# EAGLE design BTDataLogger_Schematic (EAGLE 9.2.0)
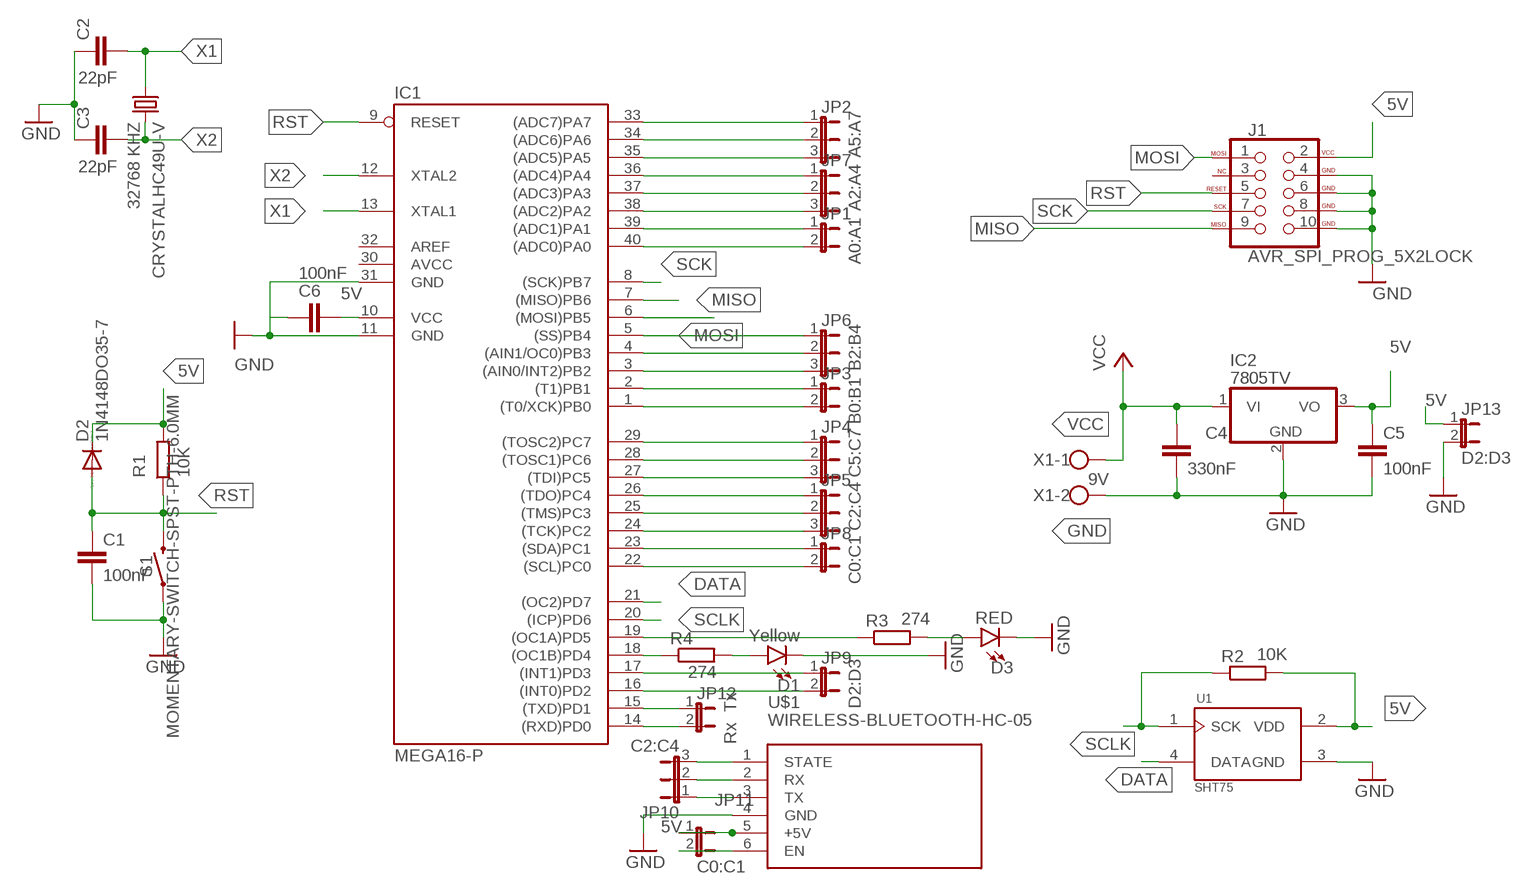
[diagram p0: schematic, sheet 1]

## Parts
C1  100nF  C-EU025-024X044  [C025-024X044]
C2  22pF  C-EU025-024X044  [C025-024X044]
C3  22pF  C-EU025-024X044  [C025-024X044]
C4  330nF  C5/3  [C5B3]
C5  100nF  C-EU025-024X044  [C025-024X044]
C6  100nF  C-EU025-024X044  [C025-024X044]
CRYSTALHC49U-V  32768 KHZ  CRYSTALHC49U-V  [HC49U-V]
D1  Yellow  LED-YELLOW0603  [LED-0603]
D2  1N4148DO35-7  [DO35-7]
D3  RED  LED-RED0603  [LED-0603]
IC1  MEGA16-P  [DIL40]
IC2  7805TV  [TO220V]
J1  AVR_SPI_PROG_5X2LOCK  [2X5-SHROUDED_LOCK]
JP1  A0:A1  JP1E  [JP1]
JP2  A5:A7  JP2E  [JP2]
JP3  B0:B1  JP1E  [JP1]
JP4  C5:C7  JP2E  [JP2]
JP5  C2:C4  JP2E  [JP2]
JP6  B2:B4  JP2E  [JP2]
JP7  A2:A4  JP2E  [JP2]
JP8  C0:C1  JP1E  [JP1]
JP9  D2:D3  JP1E  [JP1]
JP10  C2:C4  JP2E  [JP2]
JP11  C0:C1  JP1E  [JP1]
JP12  Rx Tx  JP1E  [JP1]
JP13  D2:D3  JP1E  [JP1]
R1  10K  R  (no package)
R2  10K  R-EU_0207/10  [0207/10]
R3  274  R-EU_0207/10  [0207/10]
R4  274  R-EU_0207/10  [0207/10]
S1  MOMENTARY-SWITCH-SPST-PTH-6.0MM  [TACTILE_SWITCH_PTH_6.0MM]
U1  SHT75  [SIP310W46P127L508H1350Q4P]
U$1  WIRELESS-BLUETOOTH-HC-05  [WIRELESS-BLUETOOTH-HC-05]
X1  9V  W237-102  [W237-102]

## Nets
5V: C5.1 C6.1 D2.C IC1.10(VCC) IC2.3(VO) J1.2(VCC) JP11.1 JP13.1 R1.2 R2.2 U1.2(VDD) U$1.5(+5V)
DATA: IC1.21((OC2)PD7) U1.4(DATA)
GND: C1.2 C2.1 C3.1 C4.2 C5.2 C6.2 D1.C D3.C IC1.11(GND) IC1.31(GND) IC2.2(GND) J1.4(GND) J1.6(GND) J1.8(GND) J1.10(GND) JP13.2 S1.1 U1.3(GND) U$1.4(GND) X1.2
MISO: IC1.7((MISO)PB6) J1.9(MISO)
MOSI: IC1.6((MOSI)PB5) J1.1(MOSI)
N$1: JP10.3 U$1.1(STATE)
N$2: JP10.2 U$1.2(RX)
N$3: IC1.18((OC1B)PD4) R4.1
N$4: D1.A R4.2
N$5: D3.A R3.2
N$6: IC1.19((OC1A)PD5) R3.1
N$7: IC1.33((ADC7)PA7) JP2.1
N$8: IC1.34((ADC6)PA6) JP2.2
N$9: IC1.35((ADC5)PA5) JP2.3
N$10: IC1.36((ADC4)PA4) JP7.1
N$11: IC1.37((ADC3)PA3) JP7.2
N$12: IC1.38((ADC2)PA2) JP7.3
N$13: IC1.5((SS)PB4) JP6.1
N$14: IC1.4((AIN1/OC0)PB3) JP6.2
N$15: IC1.3((AIN0/INT2)PB2) JP6.3
N$16: IC1.29((TOSC2)PC7) JP4.1
N$17: IC1.28((TOSC1)PC6) JP4.2
N$18: IC1.27((TDI)PC5) JP4.3
N$19: IC1.26((TDO)PC4) JP5.1
N$20: IC1.25((TMS)PC3) JP5.2
N$21: IC1.24((TCK)PC2) JP5.3
N$22: IC1.39((ADC1)PA1) JP1.1
N$23: IC1.40((ADC0)PA0) JP1.2
N$24: IC1.2((T1)PB1) JP3.1
N$25: IC1.1((T0/XCK)PB0) JP3.2
N$26: IC1.23((SDA)PC1) JP8.1
N$27: IC1.22((SCL)PC0) JP8.2
N$28: IC1.17((INT1)PD3) JP9.1
N$29: IC1.16((INT0)PD2) JP9.2
N$30: JP10.1 U$1.3(TX)
N$31: JP11.2 U$1.6(EN)
N$32: IC1.15((TXD)PD1) JP12.1
N$33: IC1.14((RXD)PD0) JP12.2
RST: C1.1 D2.A IC1.9(RESET) J1.5(RESET) R1.1 S1.3
SCK: IC1.8((SCK)PB7) J1.7(SCK)
SCLK: IC1.20((ICP)PD6) R2.1 U1.1(SCK)
VCC: C4.1 IC2.1(VI) X1.1
X1: C2.2 CRYSTALHC49U-V.1 IC1.13(XTAL1)
X2: C3.2 CRYSTALHC49U-V.2 IC1.12(XTAL2)
Unconnected: IC1.32(AREF) J1.3(NC)

## Power pins joined to a net without a drawn wire
AVCC: IC1.30(AVCC)

## Library data of the parts
C1-C3 C5 C6 = rcl:C-EU: CAPACITOR, European symbol; SPICEPREFIX: C
C4 = capacitor-wima:C: CAPACITOR naming: grid - package width
CRYSTALHC49U-V = crystal:CRYSTAL: CRYSTAL; OC_FARNELL: 1666969; OC_NEWARK: unknown
D1 = SparkFun-LED:LED-YELLOW: Yellow SMD LED Used in manufacturing several products at SparkFun. Packages: 0603 - SMD 0603 package[Product Link] <http://www.kingbrightusa.com/product.asp?catalog_name=LED&product_id=APT1608SYCK> 0603 -SMART - SMART SMD 0603 package (more efficient/more expensive) [Product Link] <http://www.osram-os.com/osram_os/en/products/product-catalog/led-light-emitting-diodes/smartled-0603/ly-l29k/index.jsp> LilyPad - SMD1206 package[Product Datasheet] <https://www.sparkfun.com/datasheets/DevTools/LilyPad/Q150YUS4.pdf> SparkFun Products: Blynk Board <https://www.sparkfun.com/products/13794> IOIO-OTG <https://www.sparkfun.com/products/13613> XBee Explorer Serial <https://www.sparkfun.com/products/13225>; PROD_ID: DIO-09003
D2 = diode:1N4148: DIODE high speed (Philips)
D3 = SparkFun-LED:LED-RED: Red SMD LED Used in manufacturing of most products at SparkFun Packages: 0603 - SMD 0603 package [Product Link] <http://docs.avagotech.com/docs/AV02-0551EN> 0603 SMART - SMD 0603 SMART package ( more efficient and expensive)[Product Link] <http://www.osram-os.com/Graphics/XPic2/00077099_0.pdf> 1206 - SMD1206 package [Product Link] <https://www.sparkfun.com/datasheets/DevTools/LilyPad/Q150OVS4.pdff> SparkFun Products: Pro Mini 328 -5V <https://www.sparkfun.com/products/821> RedBoard <https://www.sparkfun.com/products/12757> IOIO-OTG <https://www.sparkfun.com/products/13613>; PROD_ID: DIO-00819
IC1 = atmel:MEGA16-P: MICROCONTROLLER 16 Kbytes FLASH 1 kbytes SRAM 512 bytes EEPROM USART 8-channel 10 bit ADC Source: avr.lbr; MPN: ATMEGA16-16PU; OC_FARNELL: 9171142; OC_NEWARK: 01M6885
IC2 = linear:78*: Positive VOLTAGE REGULATOR Source: http://cache.national.com/ds/LM/LM78L05.pdf http://www.fairchildsemi.com/ds/LM/LM7805.pdf
J1 = SparkFun-Connectors:AVR_SPI_PROG_5X2: AVR 10-pin ICSP Header This is the standard AVR In Circuit Serial Programming header. Minimal, but includes pin one indicator. Works with standard Olimex programmers. SparkFun Products: 2x5 AVR ICSP Male Header <https://www.sparkfun.com/products/778> - PTH 2x5 Pin Shrouded Header <https://www.sparkfun.com/products/8506> - PTH2; PROD_ID: CONN-08671; SF_ID: PRT-08506
JP1 JP3 JP8 JP9 JP11-JP13 = jumper:JP1E: JUMPER
JP2 JP4-JP7 JP10 = jumper:JP2E: JUMPER
R1 = ngspice-simulation:R: RESISTOR
R2-R4 = rcl:R-EU_: RESISTOR, European symbol; SPICEPREFIX: R
S1 = SparkFun-Switches:MOMENTARY-SWITCH-SPST: Momentary Switch (Pushbutton) - SPST Normally-open (NO) SPST momentary switches (buttons, pushbuttons). Variants PTH-12MM - 12mm square, through-hole Momentary Pushbutton Switch - 12mm Square <https://www.sparkfun.com/products/9190> (COM-09190) PTH-6.0MM, PTH-6.0MM-KIT - 6.0mm square, through-hole Mini Pushbutton Switch <https://www.sparkfun.com/products/97> (COM-00097) KIT package intended for soldering kit's - only one side of pads' copper is exposed. PTH-RIGHT-ANGLE-KIT - Right-angle, through-hole Right Angle Tactile Button <https://www.sparkfun.com/products/10791> - Used on SparkFun BigTime Watch Kit <https://www.sparkfun.com/products/11734> SMD-12MM - 12mm square, surface-mount Tactile Button - SMD (12mm) <https://www.sparkfun.com/products/12993> (COM-12993) Used on SparkFun PicoBoard <https://www.sparkfun.com/products/11888> SMD-4.5MM - 4.5mm Square Trackball Switch Used on SparkFun Blackberry Trackballer Breakout <https://www.sparkfun.com/products/13169> SMD-4.6MMX2.8MM - 4.60mm x 2.80mm, surface mount Used on SparkFun SAMD21 Mini Breakout <https://www.sparkfun.com/products/13664> SMD-5.2MM, SMD-5.2-REDUNDANT - 5.2mm square, surface-mount Mini Pushbutton Switch - SMD <https://www.sparkfun.com/products/8720> (COM-08720) Used on Arduino Pro Mini <https://www.sparkfun.com/products/11114> REDUNDANT package connects both switch circuits together SMD-6.0X3.5MM - 6.0 x 3.5mm, surface mount Momentary Reset Switch SMD <https://www.sparkfun.com/products/8229> (COM-08229) SMD-6.2MM-TALL - 6.2mm square, surface mount Tactile Button - SMD (6mm) <https://www.sparkfun.com/products/12992> Used on SparkFun Digital Sandbox <https://www.sparkfun.com/products/12651> SMD-RIGHT-ANGLE - Right-angle, surface mount Used on SparkFun Block for Intel® Edison - Arduino <https://www.sparkfun.com/products/13036>; PROD_ID: SWCH-08441; SF_SKU: COM-00097
U1 = SHT75:SHT75: SHT7X Series 5.5 V -40 to +125°C Digital Humidity & Temperature Sensor; AVAILABILITY: Unavailable; DESCRIPTION: SHT7X Series 5.5 V -40 to +125°C Digital Humidity & Temperature Sensor; MF: Sensirion AG; MP: SHT75; PACKAGE: SIP-4 Sensirion; PRICE: None
U$1 = diy-modules:WIRELESS-BLUETOOTH-HC-05: Bluetooth Transceiver Module based on HC-05 board Tutorial is available here: https://arduino-info.wikispaces.com/BlueTooth-HC05-HC06-Modules-How-To Click here to find device on ebay.com <http://www.ebay.com/sch/hc-05+module+rs232>
X1 = con-wago-500:W237-102: WAGO SCREW CLAMP; MPN: 237-102; OC_FARNELL: unknown; OC_NEWARK: 70K9898

## Net classes
0 default: width 0.305 mm, drill 0.508 mm, clearance 0.127 mm

## Board
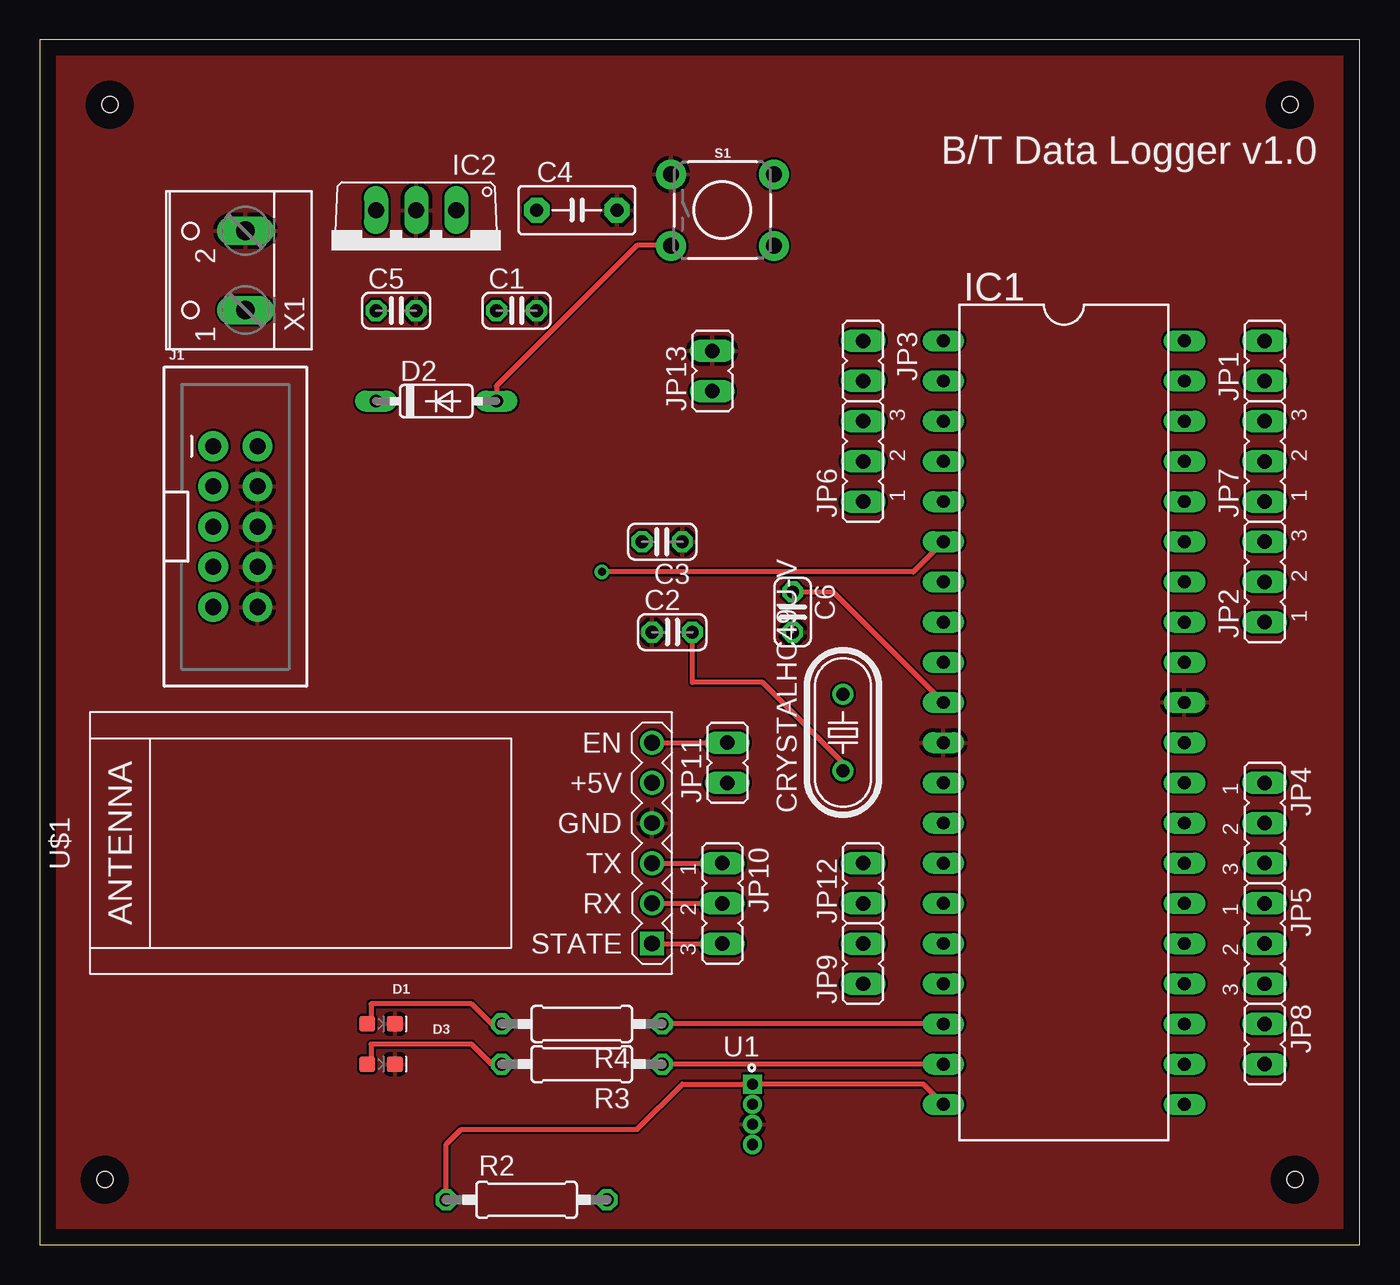
[diagram p1: board, top side]
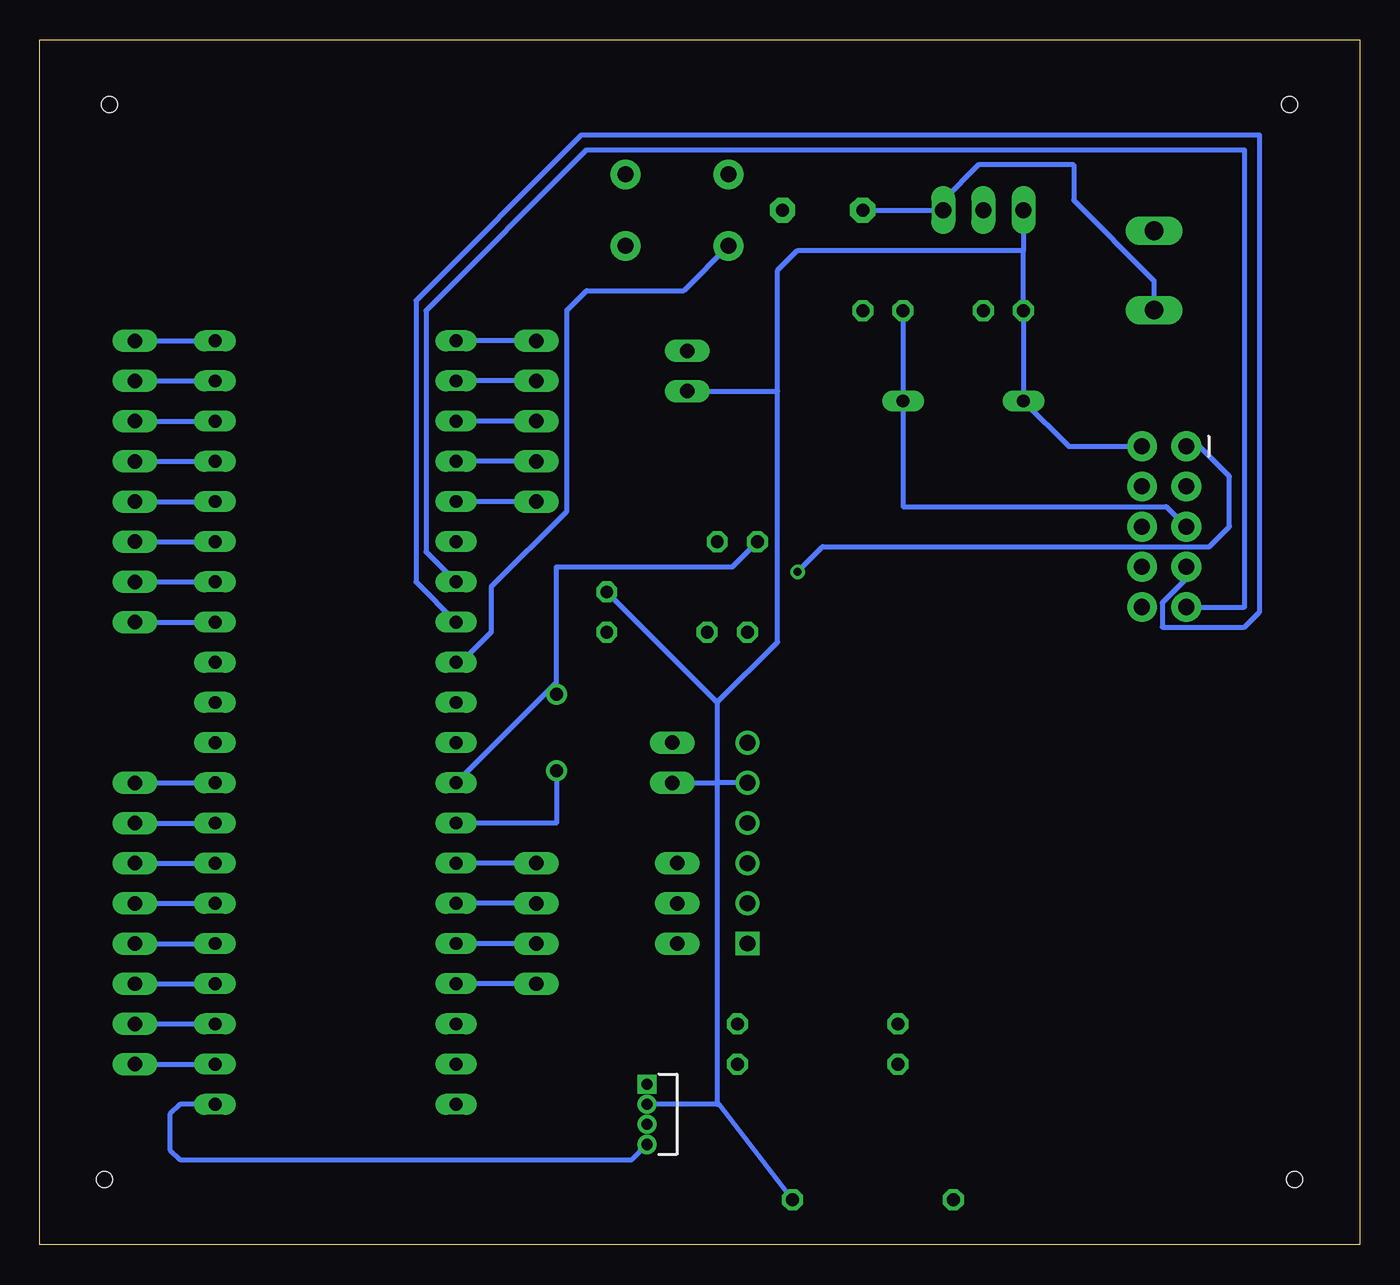
[diagram p2: board, bottom side, seen from below]

Size 83.49 x 76.19 mm. Coordinates in mm from the lower left corner, seen from the top.
Outline: 0,0 83.49,0 83.49,76.19 0,76.19 0,0
Copper layers (1*16): Top 0.035mm / dielectric 1.5mm / Bottom 0.035mm
Design rules "default": minimum track width 6mil, minimum drill 0.35mm, track to track 6mil, track to pad 6mil, pad to pad 6mil, via to via 6mil, smd to smd 6mil, copper to edge 40mil, drill to drill 6mil, minimum pad ring 10mil, minimum via ring 8mil, stop-mask expansion 4mil, vias tented up to drill 0mil, thermal gap 10mil
Holes 1 mm at 4.45,72.07 79.06,72.07 79.38,4.13 4.13,4.13

### Footprints (pad centres in the part's own frame; a part is rotated, then mirrored left to right if it is on the bottom)
C025-024X044 = drill 0.813 octagon: 1 -1.27,0; 2 1.27,0
C5B3 = drill 0.813 pad 1.6 octagon: 1 -2.54,0; 2 2.54,0
HC49U-V = drill 0.813: 1 -2.413,0; 2 2.413,0
LED-0603 = smd 1 x 1: A -0.877,0; C 0.877,0
DO35-7 = drill 0.813 long: A 3.81,0; C -3.81,0
DIL40 = drill 0.813 long: 1 -24.13,-7.62; 2 -21.59,-7.62; 3 -19.05,-7.62; 4 -16.51,-7.62; 5 -13.97,-7.62; 6 -11.43,-7.62; 7 -8.89,-7.62; 8 -6.35,-7.62; 9 -3.81,-7.62; 10 -1.27,-7.62; 11 1.27,-7.62; 12 3.81,-7.62; 13 6.35,-7.62; 14 8.89,-7.62; 15 11.43,-7.62; 16 13.97,-7.62; 17 16.51,-7.62; 18 19.05,-7.62; 19 21.59,-7.62; 20 24.13,-7.62; 21 24.13,7.62; 22 21.59,7.62; 23 19.05,7.62; 24 16.51,7.62; 25 13.97,7.62; 26 11.43,7.62; 27 8.89,7.62; 28 6.35,7.62; 29 3.81,7.62; 30 1.27,7.62; 31 -1.27,7.62; 32 -3.81,7.62; 33 -6.35,7.62; 34 -8.89,7.62; 35 -11.43,7.62; 36 -13.97,7.62; 37 -16.51,7.62; 38 -19.05,7.62; 39 -21.59,7.62; 40 -24.13,7.62
TO220V = drill 1.016 long: 1 -2.54,-2.54; 2 0,-2.54; 3 2.54,-2.54
2X5-SHROUDED_LOCK = drill 1.016 pad 1.88: 1 -1.397,5.08; 2 1.397,5.08; 3 -1.397,2.54; 4 1.397,2.54; 5 -1.397,0; 6 1.397,0; 7 -1.397,-2.54; 8 1.397,-2.54; 9 -1.397,-5.08; 10 1.397,-5.08
JP1 = drill 0.914 long: 1 0,-1.27; 2 0,1.27
JP2 = drill 0.914 long: 1 -2.54,0; 2 0,0; 3 2.54,0
0207/10 = drill 0.813 octagon: 1 -5.08,0; 2 5.08,0
TACTILE_SWITCH_PTH_6.0MM = drill 1.016 pad 1.88: 1 -3.251,2.261; 2 3.251,2.261; 3 -3.251,-2.261; 4 3.251,-2.261
SIP310W46P127L508H1350Q4P = drill 0.7 pad 1.05 square: 1 0,1.905 | drill 0.7 pad 1.05: 2 0,0.635; 3 0,-0.635; 4 0,-1.905
WIRELESS-BLUETOOTH-HC-05 = drill 1 square: 1 -6.35,-17.145 | drill 1: 2 -3.81,-17.145; 3 -1.27,-17.145; 4 1.27,-17.145; 5 3.81,-17.145; 6 6.35,-17.145
W237-102 = drill 1.194 long: 1 -2.5,-1.27; 2 2.5,-1.27

### Placement (x,y rotation side)
C1  30.16,59.05 0 top
C2  40.01,38.73 0 top
C3  39.37,44.45 180 top
C4  33.97,65.41 0 top
C5  22.54,59.05 0 top
C6  47.62,40.01 270 top
CRYSTALHC49U-V  50.8,32.38 90 top
D1  21.59,13.97 0 top
D2  25.08,53.34 0 top
D3  21.59,11.43 0 top
IC1  64.77,33.02 270 top
IC2  23.81,62.87 180 top
J1  12.38,45.4 0 top
JP1  77.47,55.88 0 top
JP2  77.47,41.91 90 top
JP3  52.07,55.88 0 top
JP4  77.47,26.67 270 top
JP5  77.47,19.05 270 top
JP6  52.07,49.53 90 top
JP7  77.47,49.53 90 top
JP8  77.47,12.7 180 top
JP9  52.07,17.78 0 top
JP10  43.18,21.59 270 top
JP11  43.5,30.48 0 top
JP12  52.07,22.86 0 top
JP13  42.55,55.24 0 top
R2  30.8,2.86 0 top
R3  34.29,11.43 180 top
R4  34.29,13.97 180 top
S1  43.18,65.41 0 top
U1  45.09,8.26 0 top
U$1  21.59,25.4 90 top
X1  11.75,61.59 90 top

### Tracks (layer width: path | path; a pad name or v marks a point on that pad's centre or on a via)
5V
  Top 0.305: IC1.10 50.16,41.27 C6.1
  Bottom 0.305: IC2.3 21.27,62.87 | J1.2 18.41,50.48 D2.C C5.1 21.27,62.87 | 40.64,8.89 40.52,8.89 R2.2 | 40.64,8.89 U1.2 | 40.64,34.29 C6.1 | 40.64,34.29 40.64,29.21 | 40.64,29.21 40.64,8.89 | 36.83,53.98 36.83,38.1 40.64,34.29 | 36.83,53.98 36.83,61.59 35.56,62.87 21.27,62.87 | U$1.5 40.64,29.21 | JP11.1 40.64,29.21 | JP13.1 36.83,53.98
DATA
  Bottom 0.305: U1.4 46.04,5.4 74.61,5.4 75.25,6.03 75.25,8.26 74.61,8.89 IC1.21
GND
  pour Top: -0.64,76.83 -0.64,-0.64 84.45,-0.64 84.45,76.83
MISO
  Bottom 0.305: IC1.7 59.05,43.81 59.05,59.05 48.9,69.22 7.3,69.22 7.3,40.32 J1.9
MOSI  (via drill 0.51)
  Top 0.305: IC1.6 55.24,42.55 v35.56,42.55
  Bottom 0.305: v35.56,42.55 33.97,44.13 9.53,44.13 8.26,45.4 8.26,48.58 10.16,50.48 J1.1
N$1
  Top 0.305: U$1.1 JP10.3
N$2
  Top 0.305: U$1.2 JP10.2
N$3
  Top 0.305: IC1.18 R4.1
N$4
  Top 0.305: R4.2 28.57,13.97 27.3,15.24 20.95,15.24 20.95,13.97 D1.A
N$5
  Top 0.305: R3.2 28.57,11.43 27.3,12.7 20.95,12.7 20.95,11.43 D3.A
N$6
  Top 0.305: IC1.19 R3.1
N$7
  Bottom 0.305: JP2.1 IC1.33
N$8
  Bottom 0.305: JP2.2 IC1.34
N$9
  Bottom 0.305: JP2.3 IC1.35
N$10
  Bottom 0.305: JP7.1 IC1.36
N$11
  Bottom 0.305: JP7.2 IC1.37
N$12
  Bottom 0.305: JP7.3 IC1.38
N$13
  Bottom 0.305: JP6.1 IC1.5
N$14
  Bottom 0.305: JP6.2 IC1.4
N$15
  Bottom 0.305: JP6.3 IC1.3
N$16
  Bottom 0.305: JP4.1 IC1.29
N$17
  Bottom 0.305: JP4.2 IC1.28
N$18
  Bottom 0.305: JP4.3 IC1.27
N$19
  Bottom 0.305: JP5.1 IC1.26
N$20
  Bottom 0.305: JP5.2 IC1.25
N$21
  Bottom 0.305: JP5.3 IC1.24
N$22
  Bottom 0.305: JP1.1 IC1.39
N$23
  Bottom 0.305: JP1.2 IC1.40
N$24
  Bottom 0.305: JP3.1 IC1.2
N$25
  Bottom 0.305: JP3.2 IC1.1
N$26
  Bottom 0.305: JP8.1 IC1.23
N$27
  Bottom 0.305: JP8.2 IC1.22
N$28
  Bottom 0.305: JP9.1 IC1.17
N$29
  Bottom 0.305: JP9.2 IC1.16
N$30
  Top 0.305: U$1.3 JP10.1
N$31
  Top 0.305: U$1.6 JP11.2
N$32
  Bottom 0.305: JP12.1 IC1.15
N$33
  Bottom 0.305: JP12.2 IC1.14
RST
  Top 0.305: D2.A 28.89,54.29 37.78,63.18 39.89,63.18 S1.3
  Bottom 0.305: C1.1 D2.A 28.89,46.67 12.26,46.67 J1.5 | S1.3 42.75,60.33 48.9,60.33 50.16,59.05 50.16,46.35 54.93,41.59 54.93,38.73 56.83,36.83 IC1.9
SCK
  Bottom 0.305: IC1.8 59.69,41.91 59.69,59.69 49.21,70.17 6.35,70.17 6.35,40.01 7.3,39.05 12.51,39.05 12.51,40.58 10.99,42.1 J1.7
SCLK
  Top 0.305: IC1.20 55.88,10.16 U1.1 40.64,10.16 37.78,7.3 26.67,7.3 25.72,6.35 R2.1
VCC
  Bottom 0.305: X1.1 13.02,60.96 18.1,66.04 18.1,68.26 24.13,68.26 26.35,66.04 IC2.1 C4.1
X1
  Top 0.305: C2.2 41.27,35.56 45.72,35.56 50.8,30.48 CRYSTALHC49U-V.1
  Bottom 0.305: IC1.13 50.8,26.67 CRYSTALHC49U-V.1
X2
  Bottom 0.305: C3.2 39.69,42.86 50.8,42.86 50.8,35.56 | CRYSTALHC49U-V.2 50.8,35.56 | 50.8,35.56 IC1.12

### Text on the board
tPlace: B/T Data Logger v1.0